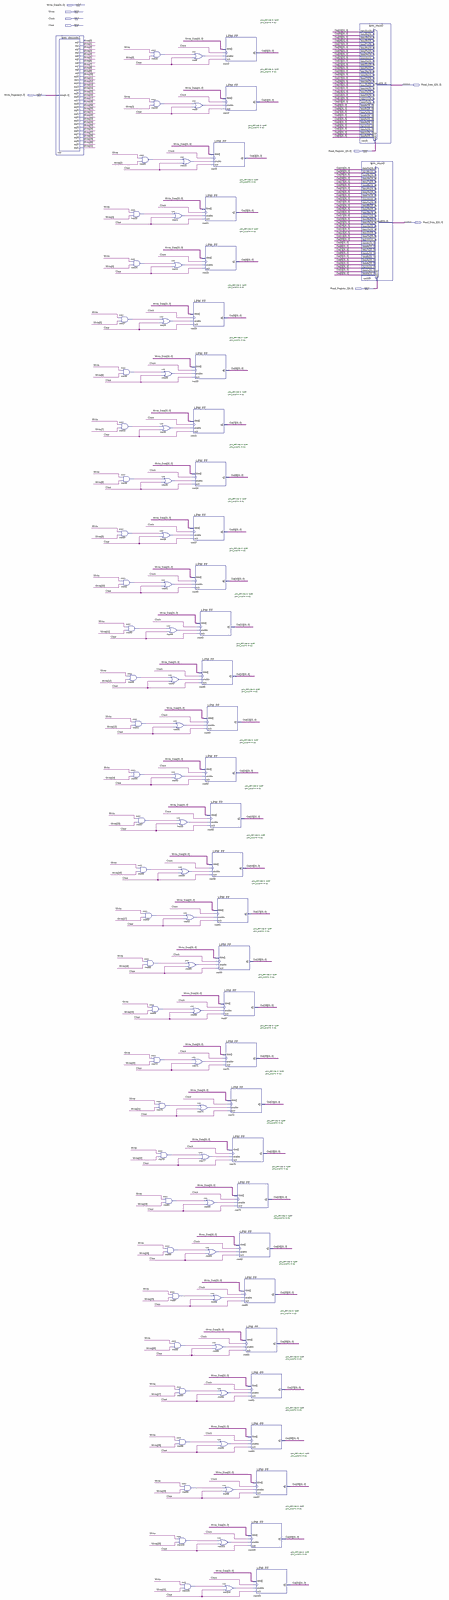
[diagram p0: schematic sheet, whole]
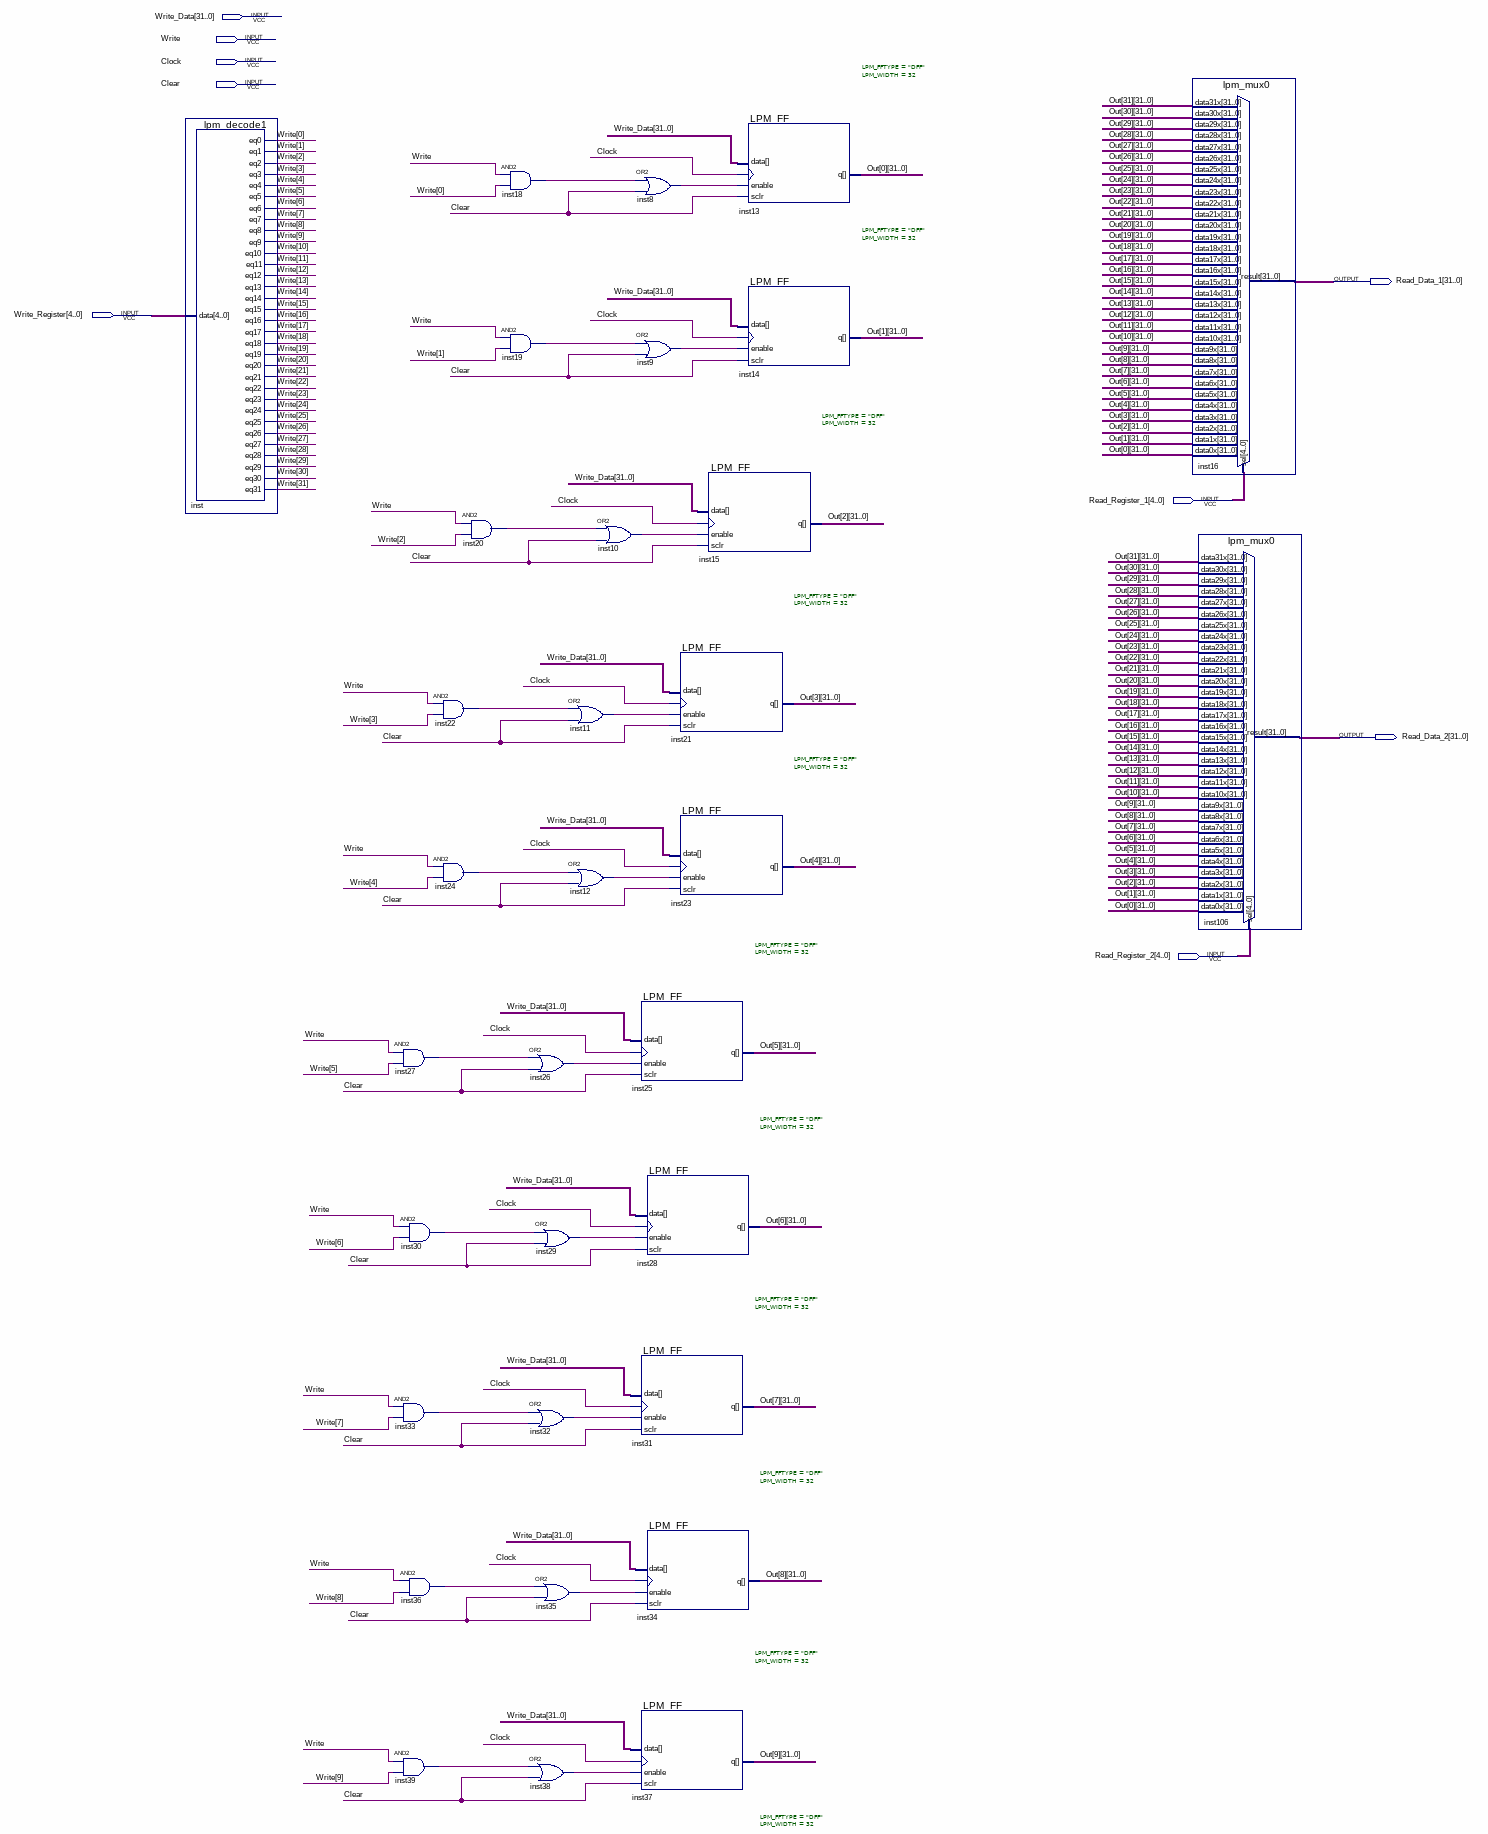
[diagram p1: schematic sheet, upper part]
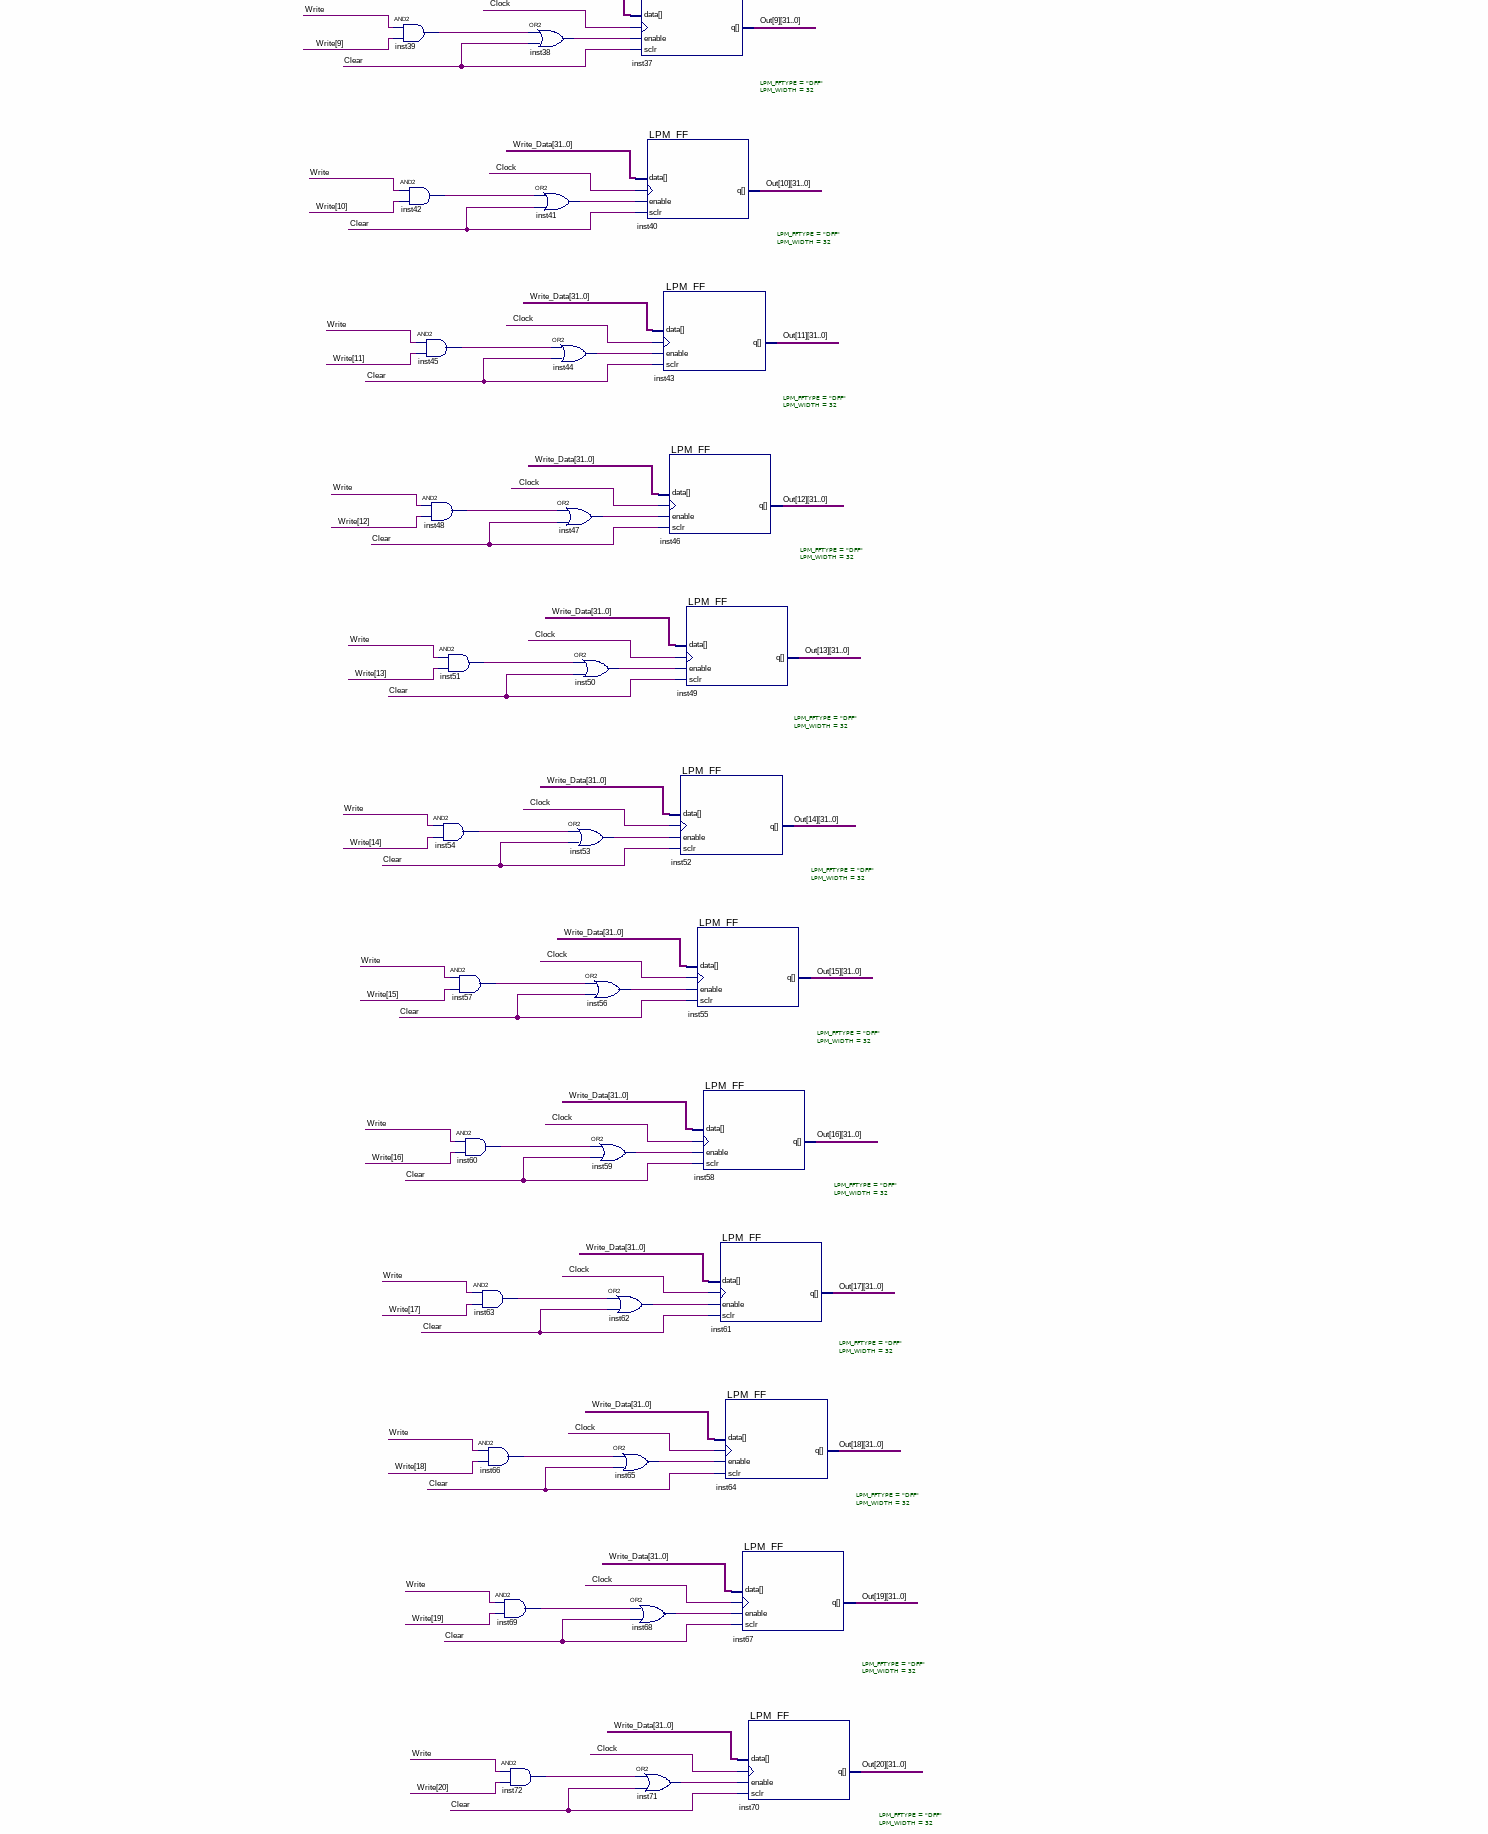
[diagram p2: schematic sheet, middle part]
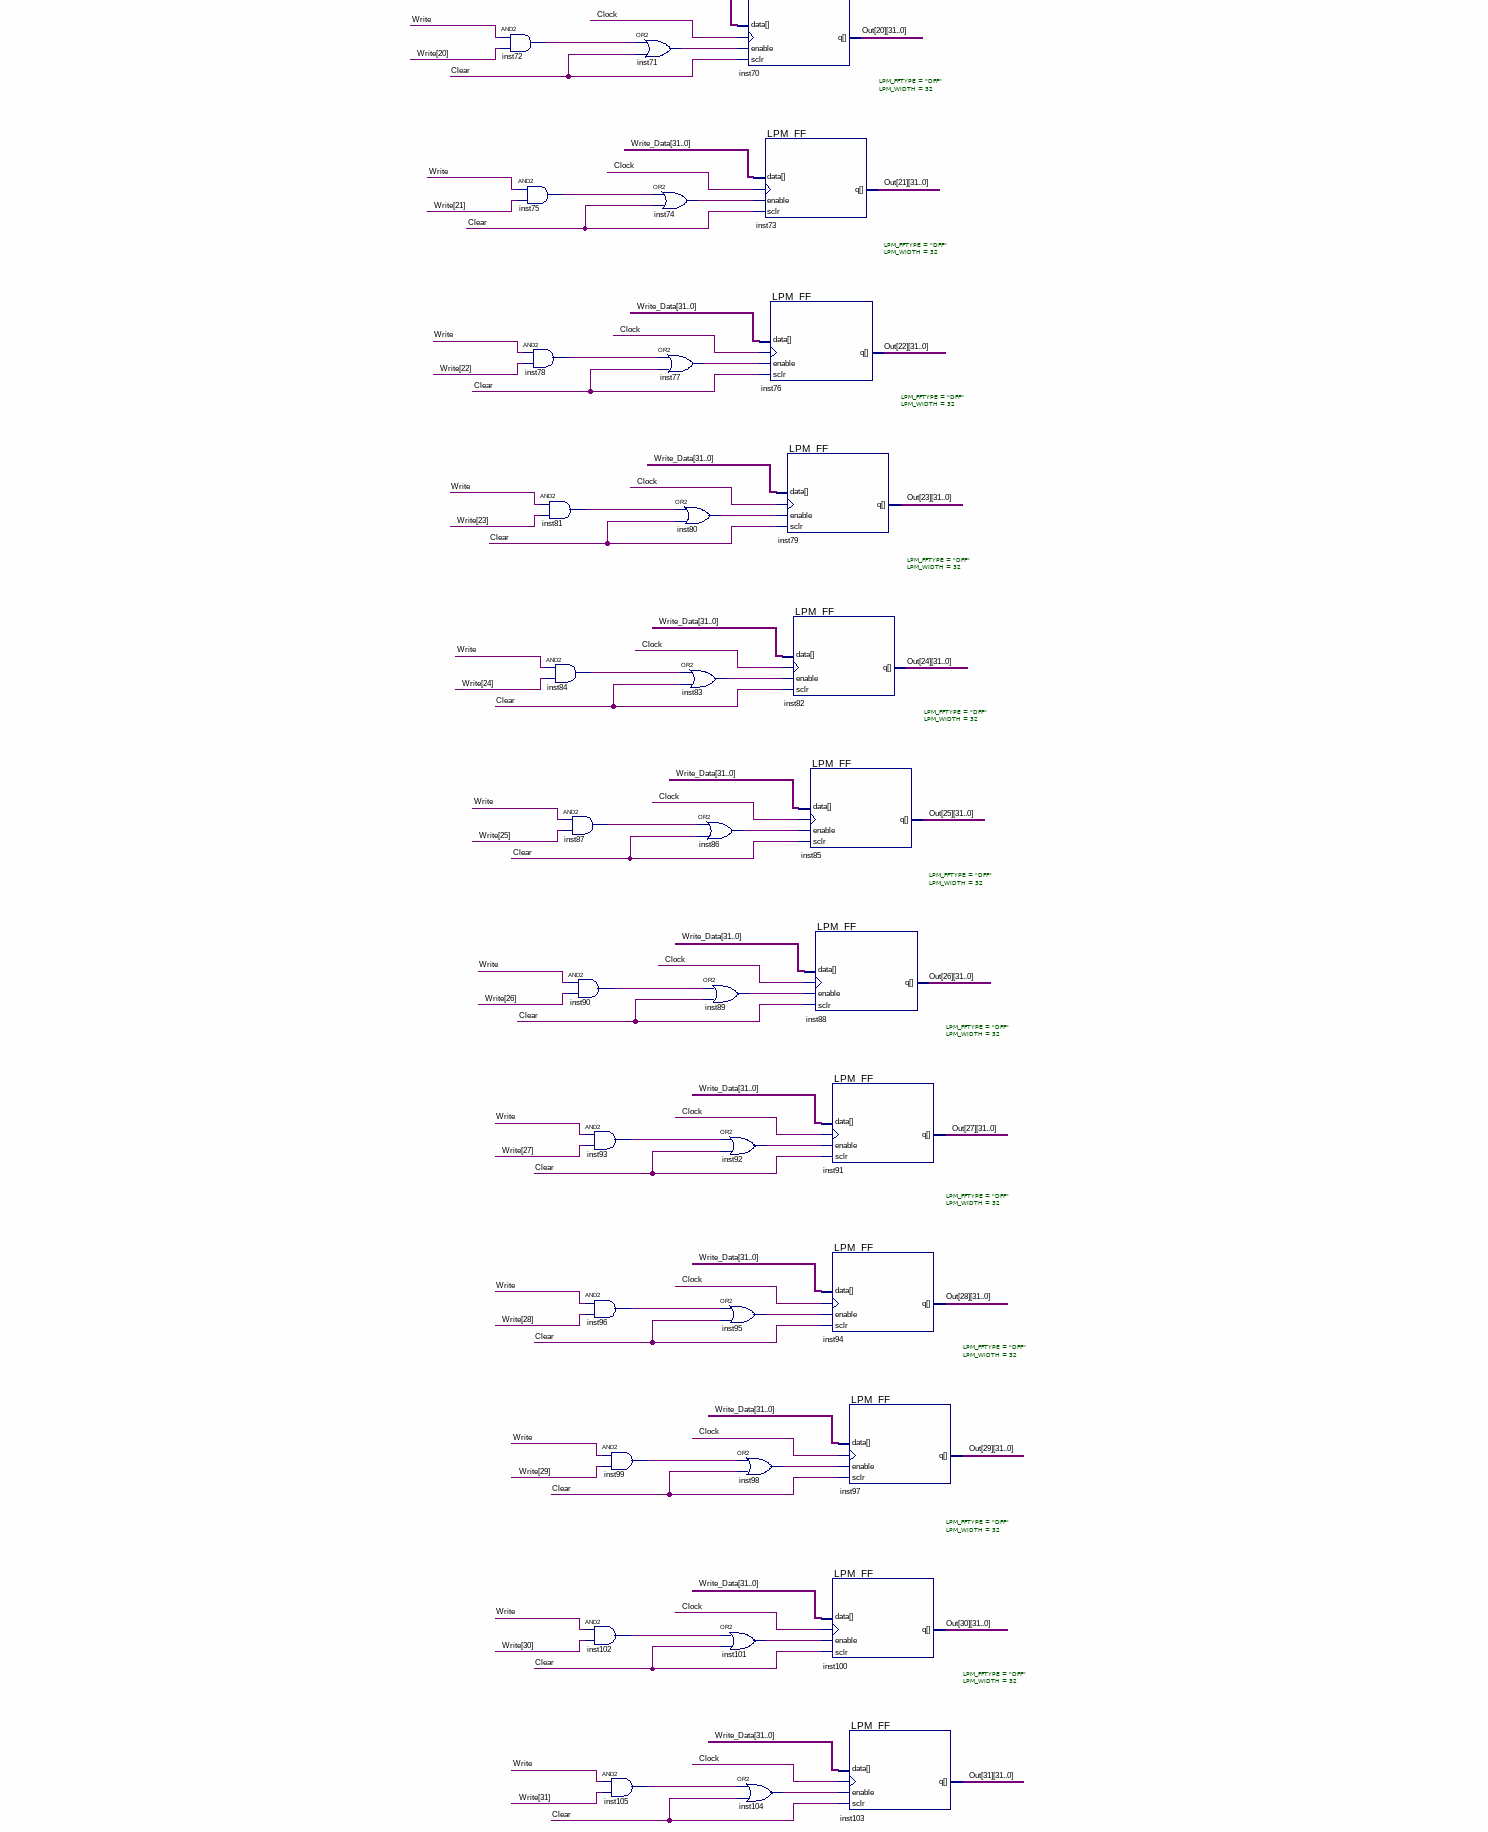
[diagram p3: schematic sheet, lower part]
// Quartus schematic RegisterFile.bdf as structural Verilog: 99 symbols, 9 pins
module RegisterFile (
  input  [31:0] Write_Data,
  input  Write,
  input  Clock,
  input  Clear,
  input  [4:0] Write_Register,
  input  [4:0] Read_Register_1,
  input  [4:0] Read_Register_2,
  output [31:0] Read_Data_1,
  output [31:0] Read_Data_2
);

  wire inst8_out, inst9_out, inst10_out, inst11_out, inst12_out, inst18_out, inst19_out, inst20_out,
       inst22_out, inst24_out, inst26_out, inst27_out, inst29_out, inst30_out, inst32_out, inst33_out,
       inst35_out, inst36_out, inst38_out, inst39_out, inst41_out, inst42_out, inst44_out, inst45_out,
       inst47_out, inst48_out, inst50_out, inst51_out, inst53_out, inst54_out, inst56_out, inst57_out,
       inst59_out, inst60_out, inst62_out, inst63_out, inst65_out, inst66_out, inst68_out, inst69_out,
       inst71_out, inst72_out, inst74_out, inst75_out, inst77_out, inst78_out, inst80_out, inst81_out,
       inst83_out, inst84_out, inst86_out, inst87_out, inst89_out, inst90_out, inst92_out, inst93_out,
       inst95_out, inst96_out, inst98_out, inst99_out, inst101_out, inst102_out, inst104_out, inst105_out;
  wire [31:0] Out_0, Out_1, Out_2, Out_3, Out_4, Out_5, Out_6, Out_7, Out_8, Out_9, Out_10, Out_11, Out_12,
       Out_13, Out_14, Out_15, Out_16, Out_17, Out_18, Out_19, Out_20, Out_21, Out_22, Out_23, Out_24,
       Out_25, Out_26, Out_27, Out_28, Out_29, Out_30, Out_31, Write_bus;

  lpm_decode1 inst (
    .data(Write_Register), .eq0(Write_bus[0]), .eq1(Write_bus[1]), .eq2(Write_bus[2]), .eq3(Write_bus[3]),
    .eq4(Write_bus[4]), .eq5(Write_bus[5]), .eq6(Write_bus[6]), .eq7(Write_bus[7]), .eq8(Write_bus[8]),
    .eq9(Write_bus[9]), .eq10(Write_bus[10]), .eq11(Write_bus[11]), .eq12(Write_bus[12]),
    .eq13(Write_bus[13]), .eq14(Write_bus[14]), .eq15(Write_bus[15]), .eq16(Write_bus[16]),
    .eq17(Write_bus[17]), .eq18(Write_bus[18]), .eq19(Write_bus[19]), .eq20(Write_bus[20]),
    .eq21(Write_bus[21]), .eq22(Write_bus[22]), .eq23(Write_bus[23]), .eq24(Write_bus[24]),
    .eq25(Write_bus[25]), .eq26(Write_bus[26]), .eq27(Write_bus[27]), .eq28(Write_bus[28]),
    .eq29(Write_bus[29]), .eq30(Write_bus[30]), .eq31(Write_bus[31]));
  and inst27 (inst27_out, Write, Write_bus[5]);
  and inst30 (inst30_out, Write, Write_bus[6]);
  and inst33 (inst33_out, Write, Write_bus[7]);
  and inst36 (inst36_out, Write, Write_bus[8]);
  and inst39 (inst39_out, Write, Write_bus[9]);
  and inst42 (inst42_out, Write, Write_bus[10]);
  and inst22 (inst22_out, Write, Write_bus[3]);
  and inst24 (inst24_out, Write, Write_bus[4]);
  and inst45 (inst45_out, Write, Write_bus[11]);
  and inst48 (inst48_out, Write, Write_bus[12]);
  and inst51 (inst51_out, Write, Write_bus[13]);
  and inst54 (inst54_out, Write, Write_bus[14]);
  and inst57 (inst57_out, Write, Write_bus[15]);
  and inst20 (inst20_out, Write, Write_bus[2]);
  and inst60 (inst60_out, Write, Write_bus[16]);
  and inst63 (inst63_out, Write, Write_bus[17]);
  and inst66 (inst66_out, Write, Write_bus[18]);
  and inst69 (inst69_out, Write, Write_bus[19]);
  and inst18 (inst18_out, Write, Write_bus[0]);
  and inst19 (inst19_out, Write, Write_bus[1]);
  or inst26 (inst26_out, inst27_out, Clear);
  or inst29 (inst29_out, inst30_out, Clear);
  or inst32 (inst32_out, inst33_out, Clear);
  or inst35 (inst35_out, inst36_out, Clear);
  or inst38 (inst38_out, inst39_out, Clear);
  or inst41 (inst41_out, inst42_out, Clear);
  and inst72 (inst72_out, Write, Write_bus[20]);
  and inst75 (inst75_out, Write, Write_bus[21]);
  and inst78 (inst78_out, Write, Write_bus[22]);
  and inst81 (inst81_out, Write, Write_bus[23]);
  or inst11 (inst11_out, inst22_out, Clear);
  or inst12 (inst12_out, inst24_out, Clear);
  or inst44 (inst44_out, inst45_out, Clear);
  or inst47 (inst47_out, inst48_out, Clear);
  or inst50 (inst50_out, inst51_out, Clear);
  or inst53 (inst53_out, inst54_out, Clear);
  or inst56 (inst56_out, inst57_out, Clear);
  and inst84 (inst84_out, Write, Write_bus[24]);
  and inst87 (inst87_out, Write, Write_bus[25]);
  and inst90 (inst90_out, Write, Write_bus[26]);
  and inst93 (inst93_out, Write, Write_bus[27]);
  and inst96 (inst96_out, Write, Write_bus[28]);
  and inst102 (inst102_out, Write, Write_bus[30]);
  or inst10 (inst10_out, inst20_out, Clear);
  LPM_FF #(.LPM_FFTYPE("DFF"), .LPM_WIDTH(32)) inst25 (
    .clock(Clock), .data(Write_Data), .enable(inst26_out), .sclr(Clear), .q(Out_5));
  LPM_FF #(.LPM_FFTYPE("DFF"), .LPM_WIDTH(32)) inst31 (
    .clock(Clock), .data(Write_Data), .enable(inst32_out), .sclr(Clear), .q(Out_7));
  LPM_FF #(.LPM_FFTYPE("DFF"), .LPM_WIDTH(32)) inst37 (
    .clock(Clock), .data(Write_Data), .enable(inst38_out), .sclr(Clear), .q(Out_9));
  or inst59 (inst59_out, inst60_out, Clear);
  or inst62 (inst62_out, inst63_out, Clear);
  or inst65 (inst65_out, inst66_out, Clear);
  or inst68 (inst68_out, inst69_out, Clear);
  and inst99 (inst99_out, Write, Write_bus[29]);
  and inst105 (inst105_out, Write, Write_bus[31]);
  or inst8 (inst8_out, inst18_out, Clear);
  or inst9 (inst9_out, inst19_out, Clear);
  LPM_FF #(.LPM_FFTYPE("DFF"), .LPM_WIDTH(32)) inst21 (
    .clock(Clock), .data(Write_Data), .enable(inst11_out), .sclr(Clear), .q(Out_3));
  LPM_FF #(.LPM_FFTYPE("DFF"), .LPM_WIDTH(32)) inst23 (
    .clock(Clock), .data(Write_Data), .enable(inst12_out), .sclr(Clear), .q(Out_4));
  LPM_FF #(.LPM_FFTYPE("DFF"), .LPM_WIDTH(32)) inst28 (
    .clock(Clock), .data(Write_Data), .enable(inst29_out), .sclr(Clear), .q(Out_6));
  LPM_FF #(.LPM_FFTYPE("DFF"), .LPM_WIDTH(32)) inst34 (
    .clock(Clock), .data(Write_Data), .enable(inst35_out), .sclr(Clear), .q(Out_8));
  LPM_FF #(.LPM_FFTYPE("DFF"), .LPM_WIDTH(32)) inst40 (
    .clock(Clock), .data(Write_Data), .enable(inst41_out), .sclr(Clear), .q(Out_10));
  LPM_FF #(.LPM_FFTYPE("DFF"), .LPM_WIDTH(32)) inst43 (
    .clock(Clock), .data(Write_Data), .enable(inst44_out), .sclr(Clear), .q(Out_11));
  LPM_FF #(.LPM_FFTYPE("DFF"), .LPM_WIDTH(32)) inst46 (
    .clock(Clock), .data(Write_Data), .enable(inst47_out), .sclr(Clear), .q(Out_12));
  LPM_FF #(.LPM_FFTYPE("DFF"), .LPM_WIDTH(32)) inst49 (
    .clock(Clock), .data(Write_Data), .enable(inst50_out), .sclr(Clear), .q(Out_13));
  LPM_FF #(.LPM_FFTYPE("DFF"), .LPM_WIDTH(32)) inst52 (
    .clock(Clock), .data(Write_Data), .enable(inst53_out), .sclr(Clear), .q(Out_14));
  or inst71 (inst71_out, inst72_out, Clear);
  or inst74 (inst74_out, inst75_out, Clear);
  or inst77 (inst77_out, inst78_out, Clear);
  or inst80 (inst80_out, inst81_out, Clear);
  LPM_FF #(.LPM_FFTYPE("DFF"), .LPM_WIDTH(32)) inst15 (
    .clock(Clock), .data(Write_Data), .enable(inst10_out), .sclr(Clear), .q(Out_2));
  LPM_FF #(.LPM_FFTYPE("DFF"), .LPM_WIDTH(32)) inst55 (
    .clock(Clock), .data(Write_Data), .enable(inst56_out), .sclr(Clear), .q(Out_15));
  LPM_FF #(.LPM_FFTYPE("DFF"), .LPM_WIDTH(32)) inst58 (
    .clock(Clock), .data(Write_Data), .enable(inst59_out), .sclr(Clear), .q(Out_16));
  LPM_FF #(.LPM_FFTYPE("DFF"), .LPM_WIDTH(32)) inst61 (
    .clock(Clock), .data(Write_Data), .enable(inst62_out), .sclr(Clear), .q(Out_17));
  LPM_FF #(.LPM_FFTYPE("DFF"), .LPM_WIDTH(32)) inst64 (
    .clock(Clock), .data(Write_Data), .enable(inst65_out), .sclr(Clear), .q(Out_18));
  or inst83 (inst83_out, inst84_out, Clear);
  or inst86 (inst86_out, inst87_out, Clear);
  or inst89 (inst89_out, inst90_out, Clear);
  or inst92 (inst92_out, inst93_out, Clear);
  or inst95 (inst95_out, inst96_out, Clear);
  or inst101 (inst101_out, inst102_out, Clear);
  LPM_FF #(.LPM_FFTYPE("DFF"), .LPM_WIDTH(32)) inst13 (
    .clock(Clock), .data(Write_Data), .enable(inst8_out), .sclr(Clear), .q(Out_0));
  LPM_FF #(.LPM_FFTYPE("DFF"), .LPM_WIDTH(32)) inst14 (
    .clock(Clock), .data(Write_Data), .enable(inst9_out), .sclr(Clear), .q(Out_1));
  LPM_FF #(.LPM_FFTYPE("DFF"), .LPM_WIDTH(32)) inst67 (
    .clock(Clock), .data(Write_Data), .enable(inst68_out), .sclr(Clear), .q(Out_19));
  LPM_FF #(.LPM_FFTYPE("DFF"), .LPM_WIDTH(32)) inst70 (
    .clock(Clock), .data(Write_Data), .enable(inst71_out), .sclr(Clear), .q(Out_20));
  LPM_FF #(.LPM_FFTYPE("DFF"), .LPM_WIDTH(32)) inst73 (
    .clock(Clock), .data(Write_Data), .enable(inst74_out), .sclr(Clear), .q(Out_21));
  LPM_FF #(.LPM_FFTYPE("DFF"), .LPM_WIDTH(32)) inst76 (
    .clock(Clock), .data(Write_Data), .enable(inst77_out), .sclr(Clear), .q(Out_22));
  or inst98 (inst98_out, inst99_out, Clear);
  or inst104 (inst104_out, inst105_out, Clear);
  LPM_FF #(.LPM_FFTYPE("DFF"), .LPM_WIDTH(32)) inst79 (
    .clock(Clock), .data(Write_Data), .enable(inst80_out), .sclr(Clear), .q(Out_23));
  LPM_FF #(.LPM_FFTYPE("DFF"), .LPM_WIDTH(32)) inst82 (
    .clock(Clock), .data(Write_Data), .enable(inst83_out), .sclr(Clear), .q(Out_24));
  LPM_FF #(.LPM_FFTYPE("DFF"), .LPM_WIDTH(32)) inst85 (
    .clock(Clock), .data(Write_Data), .enable(inst86_out), .sclr(Clear), .q(Out_25));
  LPM_FF #(.LPM_FFTYPE("DFF"), .LPM_WIDTH(32)) inst88 (
    .clock(Clock), .data(Write_Data), .enable(inst89_out), .sclr(Clear), .q(Out_26));
  LPM_FF #(.LPM_FFTYPE("DFF"), .LPM_WIDTH(32)) inst91 (
    .clock(Clock), .data(Write_Data), .enable(inst92_out), .sclr(Clear), .q(Out_27));
  LPM_FF #(.LPM_FFTYPE("DFF"), .LPM_WIDTH(32)) inst94 (
    .clock(Clock), .data(Write_Data), .enable(inst95_out), .sclr(Clear), .q(Out_28));
  LPM_FF #(.LPM_FFTYPE("DFF"), .LPM_WIDTH(32)) inst97 (
    .clock(Clock), .data(Write_Data), .enable(inst98_out), .sclr(Clear), .q(Out_29));
  LPM_FF #(.LPM_FFTYPE("DFF"), .LPM_WIDTH(32)) inst100 (
    .clock(Clock), .data(Write_Data), .enable(inst101_out), .sclr(Clear), .q(Out_30));
  LPM_FF #(.LPM_FFTYPE("DFF"), .LPM_WIDTH(32)) inst103 (
    .clock(Clock), .data(Write_Data), .enable(inst104_out), .sclr(Clear), .q(Out_31));
  lpm_mux0 inst16 (
    .data31x(Out_31), .data30x(Out_30), .data29x(Out_29), .data28x(Out_28), .data27x(Out_27),
    .data26x(Out_26), .data25x(Out_25), .data24x(Out_24), .data23x(Out_23), .data22x(Out_22),
    .data21x(Out_21), .data20x(Out_20), .data19x(Out_19), .data18x(Out_18), .data17x(Out_17),
    .data16x(Out_16), .data15x(Out_15), .data14x(Out_14), .data13x(Out_13), .data12x(Out_12),
    .data11x(Out_11), .data10x(Out_10), .data9x(Out_9), .data8x(Out_8), .data7x(Out_7), .data6x(Out_6),
    .data5x(Out_5), .data4x(Out_4), .data3x(Out_3), .data2x(Out_2), .data1x(Out_1), .data0x(Out_0),
    .sel(Read_Register_1), .result(Read_Data_1));
  lpm_mux0 inst106 (
    .data31x(Out_31), .data30x(Out_30), .data29x(Out_29), .data28x(Out_28), .data27x(Out_27),
    .data26x(Out_26), .data25x(Out_25), .data24x(Out_24), .data23x(Out_23), .data22x(Out_22),
    .data21x(Out_21), .data20x(Out_20), .data19x(Out_19), .data18x(Out_18), .data17x(Out_17),
    .data16x(Out_16), .data15x(Out_15), .data14x(Out_14), .data13x(Out_13), .data12x(Out_12),
    .data11x(Out_11), .data10x(Out_10), .data9x(Out_9), .data8x(Out_8), .data7x(Out_7), .data6x(Out_6),
    .data5x(Out_5), .data4x(Out_4), .data3x(Out_3), .data2x(Out_2), .data1x(Out_1), .data0x(Out_0),
    .sel(Read_Register_2), .result(Read_Data_2));
endmodule
